# Altium schematic sheet WX0.007.101DL.SchDoc
size A3
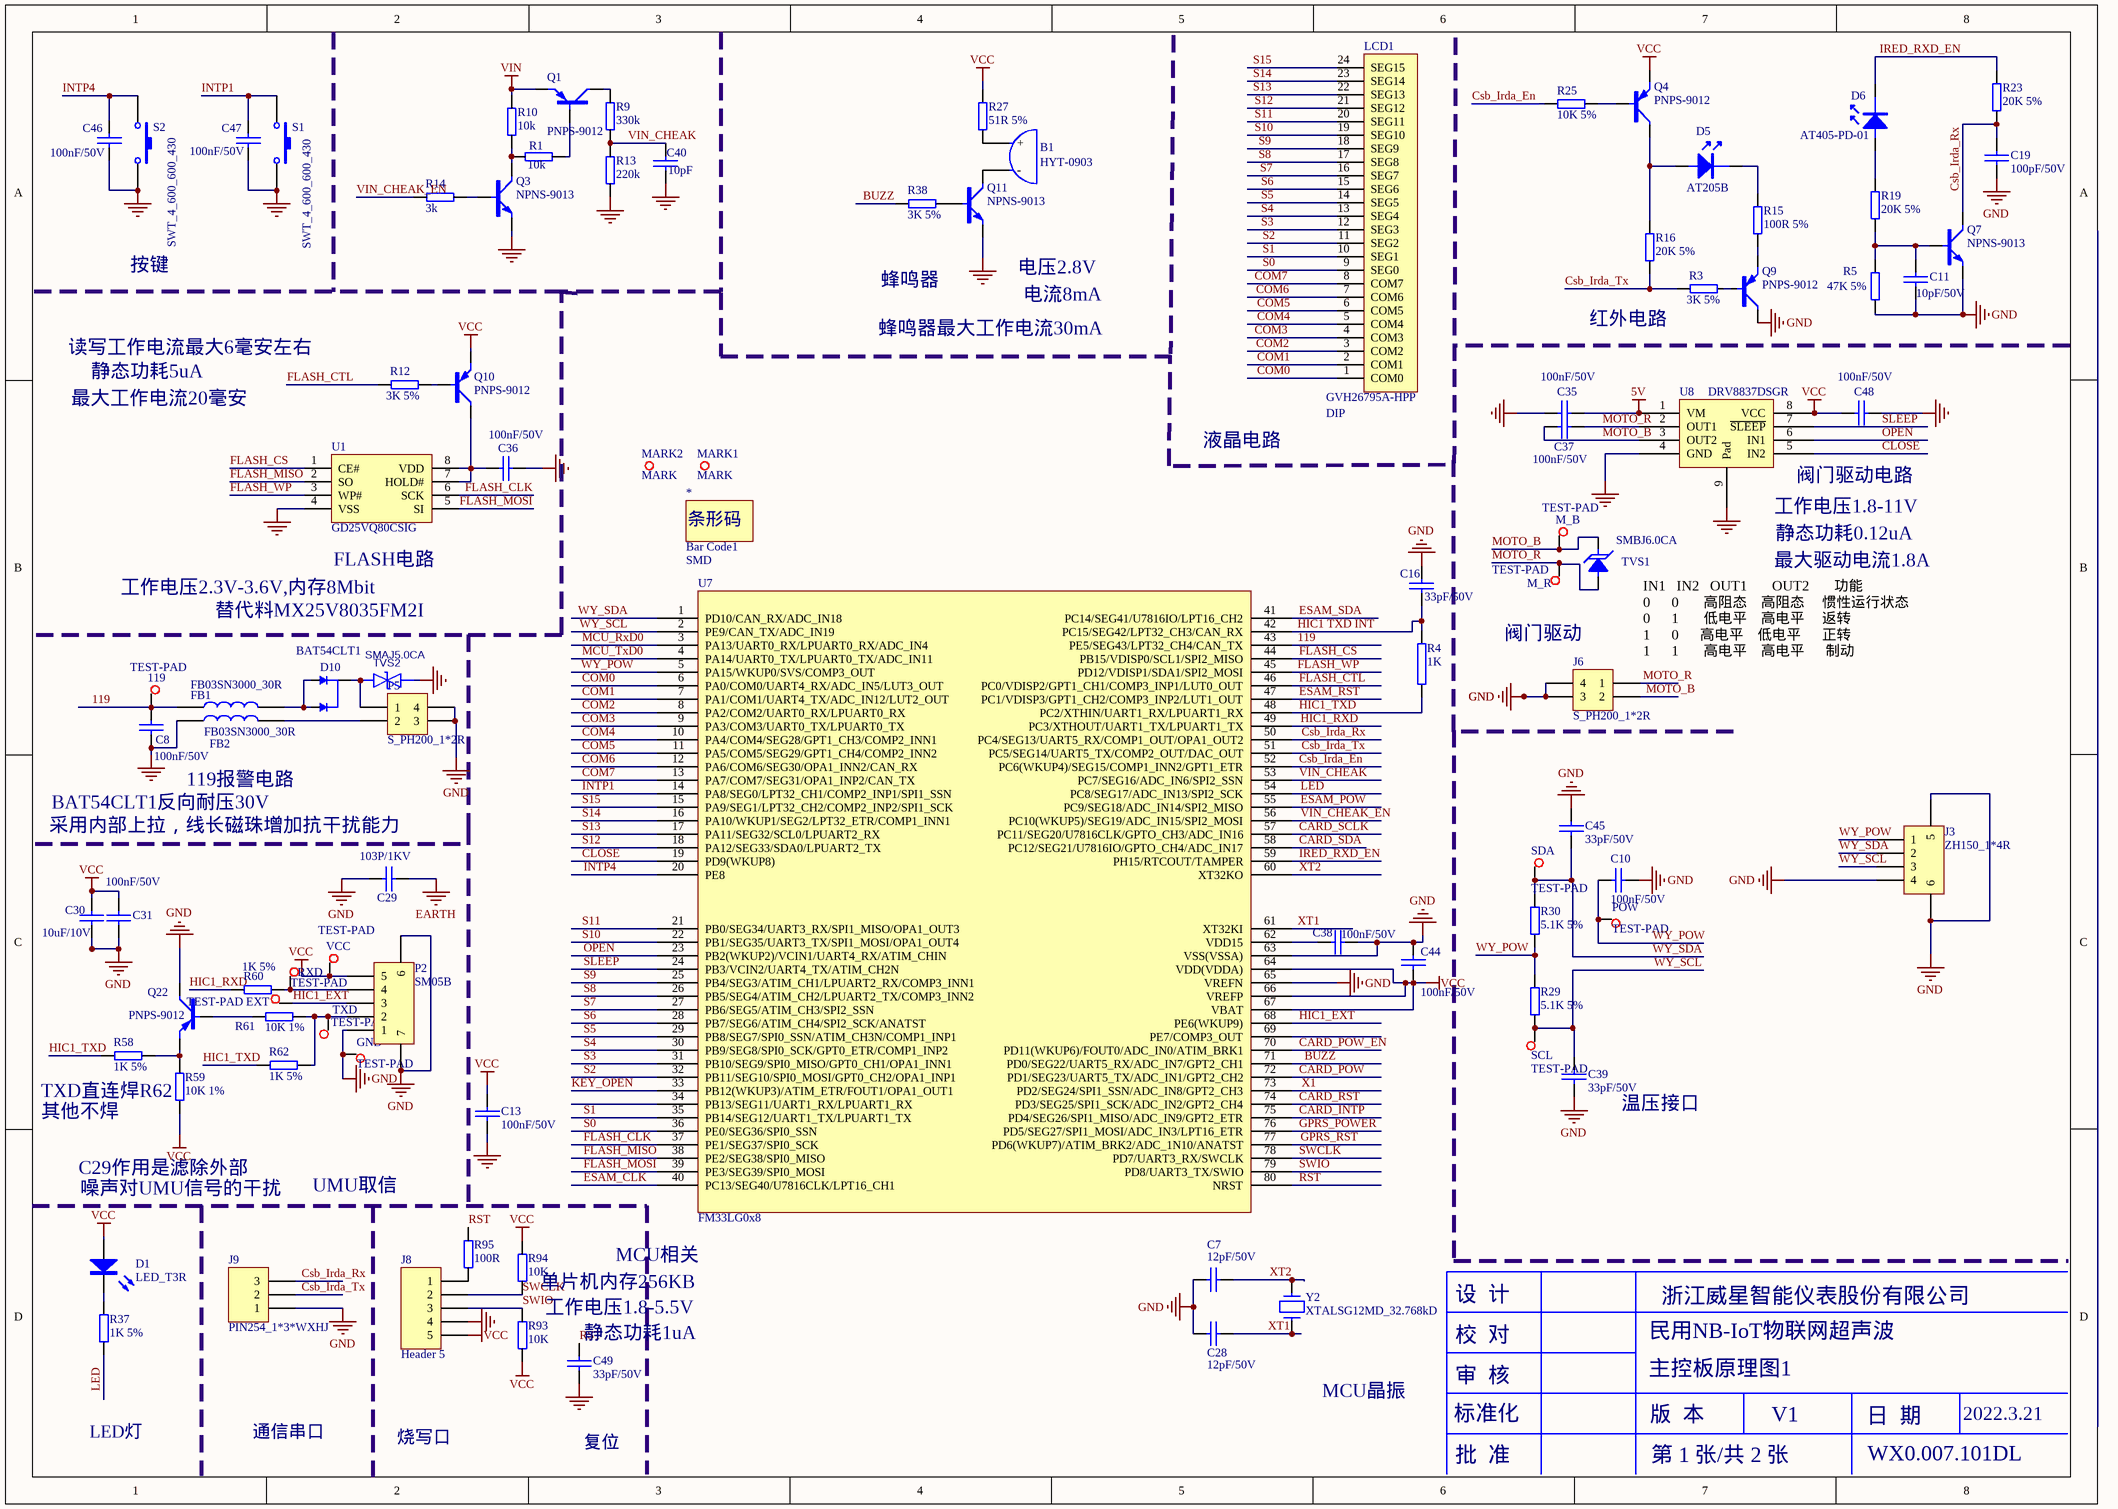
[diagram p0: WX0.007.101DL.SchDoc]

## Parts
119  TEST-PAD  [TEST-PAD]
*  Bar Code1  SMD/DIP: SMD  [Bar Code1]
B1  HYT-0903  [HYT-0903]
C7  12pF/50V  [CAP0603]
C8  100nF/50V  [CAP0603]
C10  100nF/50V  [CAP0603]
C11  10pF/50V  [CAP0603]
C13  100nF/50V  [CAP0603]
C16  33pF/50V  [CAP0603]
C19  100pF/50V  [CAP0603]
C28  12pF/50V  [CAP0603]
C29  103P/1KV  [CAP1206]
C30  10uF/10V  [CAP0603]
C31  100nF/50V  [CAP0603]
C35  100nF/50V  [CAP0603]
C36  100nF/50V  [CAP0603]
C37  100nF/50V  [CAP0603]
C38  100nF/50V  [CAP0603]
C39  33pF/50V  [CAP0603]
C40  10pF  [CAP0603]
C44  100nF/50V  [CAP0603]
C45  33pF/50V  [CAP0603]
C46  100nF/50V  [CAP0603]
C47  100nF/50V  [CAP0603]
C48  100nF/50V  [CAP0603]
C49  33pF/50V  [CAP0603]
D1  LED_T3R  [LED2_300]
D5  AT205B  [IR_254_1000_500]
D6  AT405-PD-01  [IR_254_1000_500]
D10  BAT54CLT1  [SOT-23]
EXT  TEST-PAD  [TEST-PAD]
FB1  FB03SN3000_30R  [IND0603]
FB2  FB03SN3000_30R  [IND0603]
GND  TEST-PAD  [TEST-PAD]
J3  ZH150_1*4R  [SMT-1.5-4]
J6  S_PH200_1*2R  [SMT2-2.0]
J8  Header 5  [PIN254_1*5SR]
J9  PIN254_1*3*WXHJ  [PIN254_1*3*WXHJ]
LCD1  GVH26795A-HPP  SMD/DIP: DIP  [JR-H25808ARP]
M_B  TEST-PAD  [TEST-PAD]
M_R  TEST-PAD  [TEST-PAD]
MARK1  MARK  [MARK]
MARK2  MARK  [MARK]
P2  SM05B  [SMT-1.25-5]
P5  S_PH200_1*2R  [SMT2-2.0]
POW  TEST-PAD  [TEST-PAD]
Q1  PNPS-9012  [SOT-23]
Q3  NPNS-9013  [SOT-23]
Q4  PNPS-9012  [SOT-23]
Q7  NPNS-9013  [SOT-23]
Q9  PNPS-9012  [SOT-23]
Q10  PNPS-9012  [SOT-23]
Q11  NPNS-9013  [SOT-23]
Q22  PNPS-9012  [SOT-23]
R1  10k  [RES0603]
R3  3K 5%  [RES0603]
R4  1K  [RES0603]
R5  47K 5%  [RES0603]
R9  330k  [RES0603]
R10  10k  [RES0603]
R12  3K 5%  [RES0603]
R13  220k  [RES0603]
R14  3k  [RES0603]
R15  100R 5%  [RES0603]
R16  20K 5%  [RES0603]
R19  20K 5%  [RES0603]
R23  20K 5%  [RES0603]
R25  10K 5%  [RES0603]
R27  51R 5%  [RES0603]
R29  5.1K 5%  [RES0603]
R30  5.1K 5%  [RES0603]
R37  1K 5%  [RES0603]
R38  3K 5%  [RES0603]
R58  1K 5%  [RES0603]
R59  10K 1%  [RES0603]
R60  1K 5%  [RES0603]
R61  10K 1%  [RES0603]
R62  1K 5%  [RES0603]
R93  10K  [RES0603]
R94  10K  [RES0603]
R95  100R  [RES0603]
RXD  TEST-PAD  [TEST-PAD]
S1  SWT_4_600_600_430  [SWT_4_600_600]
S2  SWT_4_600_600_430  [SWT_4_600_600]
SCL  TEST-PAD  [TEST-PAD]
SDA  TEST-PAD  [TEST-PAD]
TVS1  SMBJ6.0CA  [DO-214AA]
TVS2  SMAJ5.0CA  [SMAJ5.0CA]
TXD  TEST-PAD  [TEST-PAD]
U1  GD25VQ80CSIG  [SOP-8L-200MIL]
U7  FM33LG0x8  [LQFP80]
U8  DRV8837DSGR  [S-PWSON-N8]
VCC  TEST-PAD  [TEST-PAD]
Y2  XTALSG12MD_32.768kD  [SMD-3215_2P]

## Nets
5V: C35.1 U8.1(VM)
EARTH: C29.1
GND: C7.1 C8.2 C10.2 C11.2 C13.1 C16.2 C19.2 C28.1 C29.2 C30.2 C31.2 C35.2 C36.2 C38.2 C39.1 C40.1 C44.1 C45.2 C46.1 C47.1 C48.1 C49.1 FB2.1 GND.1 J3.4 J3.5 J3.6 J6.3 J6.4 J8.4 J9.1 P2.1 P2.6 P2.7 P5.3 P5.4 Q3.2(E) Q7.2(E) Q9.3(C) Q11.2(E) Q22.3(C) R5.1 R13.2 S1.2 S2.2 TVS2.2 U1.4(VSS) U7.63(VSS(VSSA)) U7.65(VREFN) U8.4(GND) U8.9(Pad)
VCC: C13.2 C30.1 C31.1 C44.2 C48.2 D1.1 J8.5 P2.5 Q4.2(E) Q10.2(E) R27.2 R59.2 R93.1 R94.2 U7.64(VDD(VDDA)) U7.66(VREFP) U7.67(VBAT) U8.8(VCC) VCC.1
VIN: Q1.2(E) R10.2
119: 119.1 C8.1 FB1.1 U7.43(PE5/SEG43/LPT32_CH4/CAN_TX)
BUZZ: R38.1 U7.71(PD0/SEG22/UART5_RX/ADC_IN7/GPT2_CH1)
CARD_INTP: U7.75(PD4/SEG26/SPI1_MISO/ADC_IN9/GPT2_ETR)
CARD_POW: U7.72(PD1/SEG23/UART5_TX/ADC_IN1/GPT2_CH2)
CARD_POW_EN: U7.70(PD11(WKUP6)/FOUT0/ADC_IN0/ATIM_BRK1)
CARD_RST: U7.74(PD3/SEG25/SPI1_SCK/ADC_IN2/GPT2_CH4)
CARD_SCLK: U7.57(PC11/SEG20/U7816CLK/GPTO_CH3/ADC_IN16)
CARD_SDA: U7.58(PC12/SEG21/U7816IO/GPTO_CH4/ADC_IN17)
CLOSE: U7.19(PD9(WKUP8)) U8.5(IN2)
COM0: LCD1.1(COM0) U7.6(PA0/COM0/UART4_RX/ADC_IN5/LUT3_OUT)
COM1: LCD1.2(COM1) U7.7(PA1/COM1/UART4_TX/ADC_IN12/LUT2_OUT)
COM2: LCD1.3(COM2) U7.8(PA2/COM2/UART0_RX/LPUART0_RX)
COM3: LCD1.4(COM3) U7.9(PA3/COM3/UART0_TX/LPUART0_TX)
COM4: LCD1.5(COM4) U7.10(PA4/COM4/SEG28/GPT1_CH3/COMP2_INN1)
COM5: LCD1.6(COM5) U7.11(PA5/COM5/SEG29/GPT1_CH4/COMP2_INN2)
COM6: LCD1.7(COM6) U7.12(PA6/COM6/SEG30/OPA1_INN2/CAN_RX)
COM7: LCD1.8(COM7) U7.13(PA7/COM7/SEG31/OPA1_INP2/CAN_TX)
Csb_Irda_En: R25.2 U7.52(PC6(WKUP4)/SEG15/COMP1_INN2/GPT1_ETR)
Csb_Irda_Rx: C19.1 J9.3 Q7.3(C) R23.1 U7.50(PC4/SEG13/UART5_RX/COMP1_OUT/OPA1_OUT2)
Csb_Irda_Tx: J9.2 R3.1 R16.1 U7.51(PC5/SEG14/UART5_TX/COMP2_OUT/DAC_OUT)
ESAM_CLK: U7.40(PC13/SEG40/U7816CLK/LPT16_CH1)
ESAM_POW: U7.55(PC9/SEG18/ADC_IN14/SPI2_MISO)
ESAM_RST: U7.47(PC1/VDISP3/GPT1_CH2/COMP3_INP2/LUT1_OUT)
ESAM_SDA: U7.41(PC14/SEG41/U7816IO/LPT16_CH2)
FLASH_CLK: U1.6(SCK) U7.37(PE1/SEG37/SPI0_SCK)
FLASH_CS: U1.1(CE#) U7.44(PB15/VDISP0/SCL1/SPI2_MISO)
FLASH_CTL: R12.1 U7.46(PC0/VDISP2/GPT1_CH1/COMP3_INP1/LUT0_OUT)
FLASH_MISO: U1.2(SO) U7.38(PE2/SEG38/SPI0_MISO)
FLASH_MOSI: U1.5(SI) U7.39(PE3/SEG39/SPI0_MOSI)
FLASH_WP: U1.3(WP#) U7.45(PD12/VDISP1/SDA1/SPI2_MOSI)
GPRS_POWER: U7.76(PD5/SEG27/SPI1_MOSI/ADC_IN3/LPT16_ETR)
GPRS_RST: U7.77(PD6(WKUP7)/ATIM_BRK2/ADC_1N10/ANATST)
HIC1 TXD INT: C16.1 R4.2 U7.42(PC15/SEG42/LPT32_CH3/CAN_RX)
HIC1_EXT: EXT.1 P2.3 U7.68(PE6(WKUP9))
HIC1_RXD: R60.1 U7.49(PC3/XTHOUT/UART1_TX/LPUART1_TX)
HIC1_TXD: R4.1 R58.1 R62.1 U7.48(PC2/XTHIN/UART1_RX/LPUART1_RX)
INTP1: C47.2 S1.1 U7.14(PA8/SEG0/LPT32_CH1/COMP2_INP1/SPI1_SSN)
INTP4: C46.2 S2.1 U7.20(PE8)
IRED_RXD_EN: D6.2 R23.2 U7.59(PH15/RTCOUT/TAMPER)
KEY_OPEN: U7.33(PB12(WKUP3)/ATIM_ETR/FOUT1/OPA1_OUT1)
LED: R37.1 U7.54(PC8/SEG17/ADC_IN13/SPI2_SCK)
MCU_RxD0: U7.3(PA13/UART0_RX/LPUART0_RX/ADC_IN4)
MCU_TxD0: U7.4(PA14/UART0_TX/LPUART0_TX/ADC_IN11)
MOTO_B: C37.2 J6.2 M_B.1 TVS1.2 U8.3(OUT2)
MOTO_R: C37.1 J6.1 M_R.1 TVS1.1 U8.2(OUT1)
OPEN: U7.23(PB2(WKUP2)/VCIN1/UART4_RX/ATIM_CHIN) U8.6(IN1)
RST: C49.2 R95.1 U7.80(NRST)
S0: LCD1.9(SEG0) U7.36(PE0/SEG36/SPI0_SSN)
S1: LCD1.10(SEG1) U7.35(PB14/SEG12/UART1_TX/LPUART1_TX)
S2: LCD1.11(SEG2) U7.32(PB11/SEG10/SPI0_MOSI/GPT0_CH2/OPA1_INP1)
S3: LCD1.12(SEG3) U7.31(PB10/SEG9/SPI0_MISO/GPT0_CH1/OPA1_INN1)
S4: LCD1.13(SEG4) U7.30(PB9/SEG8/SPI0_SCK/GPT0_ETR/COMP1_INP2)
S5: LCD1.14(SEG5) U7.29(PB8/SEG7/SPI0_SSN/ATIM_CH3N/COMP1_INP1)
S6: LCD1.15(SEG6) U7.28(PB7/SEG6/ATIM_CH4/SPI2_SCK/ANATST)
S7: LCD1.16(SEG7) U7.27(PB6/SEG5/ATIM_CH3/SPI2_SSN)
S8: LCD1.17(SEG8) U7.26(PB5/SEG4/ATIM_CH2/LPUART2_TX/COMP3_INN2)
S9: LCD1.18(SEG9) U7.25(PB4/SEG3/ATIM_CH1/LPUART2_RX/COMP3_INN1)
S10: LCD1.19(SEG10) U7.22(PB1/SEG35/UART3_TX/SPI1_MOSI/OPA1_OUT4)
S11: LCD1.20(SEG11) U7.21(PB0/SEG34/UART3_RX/SPI1_MISO/OPA1_OUT3)
S12: LCD1.21(SEG12) U7.18(PA12/SEG33/SDA0/LPUART2_TX)
S13: LCD1.22(SEG13) U7.17(PA11/SEG32/SCL0/LPUART2_RX)
S14: LCD1.23(SEG14) U7.16(PA10/WKUP1/SEG2/LPT32_ETR/COMP1_INN1)
S15: LCD1.24(SEG15) U7.15(PA9/SEG1/LPT32_CH2/COMP2_INP2/SPI1_SCK)
SLEEP: U7.24(PB3/VCIN2/UART4_TX/ATIM_CH2N) U8.7(~{SLEEP})
SWCLK: J8.2 R94.1 U7.78(PD7/UART3_RX/SWCLK)
SWIO: J8.3 R93.2 U7.79(PD8/UART3_TX/SWIO)
VIN_CHEAK: C40.2 R9.2 R13.1 U7.53(PC7/SEG16/ADC_IN6/SPI2_SSN)
VIN_CHEAK_EN: R14.1 U7.56(PC10(WKUP5)/SEG19/ADC_IN15/SPI2_MOSI)
WY_POW: C10.1 J3.1 POW.1 R29.1 R30.1 U7.5(PA15/WKUP0/SVS/COMP3_OUT)
WY_SCL: C39.2 J3.3 R29.2 SCL.1 U7.2(PE9/CAN_TX/ADC_IN19)
WY_SDA: C45.1 J3.2 R30.2 SDA.1 U7.1(PD10/CAN_RX/ADC_IN18)
X1: U7.73(PD2/SEG24/SPI1_SSN/ADC_IN8/GPT2_CH3)
XT1: C28.2 U7.61(XT32KI) Y2.1
XT2: C7.2 U7.60(XT32KO) Y2.2
NetB1_1: B1.1(+) R27.1
NetB1_2: B1.2(-) Q11.3(C)
NetC11_1: C11.1 Q7.1(B) R5.2 R19.1
NetC36_1: C36.1 Q10.3(C) U1.7(HOLD#) U1.8(VDD)
NetC38_1: C38.1 U7.62(VDD15)
NetD1_2: D1.2 R37.2
NetD5_1: D5.1 Q4.3(C) R16.2
NetD5_2: D5.2 R15.2
NetD6_1: D6.1 R19.2
NetD10_1: D10.1(A) D10.2(A) FB1.2
NetD10_3: D10.3(C) P5.1 TVS2.1
NetFB2_2: FB2.2 P5.2
NetJ8_1: J8.1 R95.2
NetP2_2: P2.2 R61.2 R62.2 TXD.1
NetP2_4: P2.4 R60.2 RXD.1
NetQ1_1: Q1.1(B) R1.2
NetQ1_3: Q1.3(C) R9.1
NetQ3_1: Q3.1(B) R14.2
NetQ3_3: Q3.3(C) R1.1 R10.1
NetQ4_1: Q4.1(B) R25.1
NetQ9_1: Q9.1(B) R3.2
NetQ9_2: Q9.2(E) R15.1
NetQ10_1: Q10.1(B) R12.2
NetQ11_1: Q11.1(B) R38.2
NetQ22_1: Q22.1(B) R61.1
NetQ22_2: Q22.2(E) R58.2 R59.1

Not connected (* = marked no-connect by the designer): U7 34(PB13/SEG11/UART1_RX/LPUART1_RX) 69(PE7/COMP3_OUT)

## Notes on the sheet
- 按键
- 蜂鸣器
- (near Q11) 电压2.8V
- 电流8mA
- 读写工作电流最大6毫安左右
- 静态功耗5uA
- 蜂鸣器最大工作电流30mA
- 红外电路
- 最大工作电流20毫安
- 液晶电路
- (near U8) 工作电压1.8-11V
- (near U8) 阀门驱动电路
- (near U1) FLASH电路
- 最大驱动电流1.8A
- 静态功耗0.12uA
- 工作电压2.3V-3.6V,内存8Mbit
- 替代料MX25V8035FM2I
- 阀门驱动
- IN1   IN2   OUT1       OUT2       功能
  0      0       高阻态    高阻态     惯性运行状态
  0      1       低电平    高电平     返转
  1      0      高电平    低电平      正转
  1      1       高电平    高电平      制动
- 119报警电路
- 采用内部上拉，线长磁珠增加抗干扰能力
- BAT54CLT1反向耐压30V
- (near R58) TXD直连焊R62
- 其他不焊
- (near C39) 温压接口
- C29作用是滤除外部
- UMU取信
- 噪声对UMU信号的干扰
- MCU相关
- 工作电压1.8-5.5V
- 单片机内存256KB
- 静态功耗1uA
- 设  计
- 浙江威星智能仪表股份有限公司
- MCU晶振
- 审  核
- 校  对
- 民用NB-IoT物联网超声波
- 主控板原理图1
- LED灯
- 通信串口
- 烧写口
- 复位
- 标准化
- 批  准
- 版  本
- 第 1 张/共 2 张
- V1
- 日  期
- WX0.007.101DL
- 2022.3.21

## Library data of the parts
119 EXT GND M_B M_R POW RXD SCL SDA TXD VCC = AD_WXHJ_TEST-PAD_01: 单面焊盘测试点; Part Name: 测试点; ID: 23; SMD/DIP: SMD; Part Number: AD_WXHJ_TEST-PAD_01
* = AD_WXHJ_Bar Code_02: 条形码 ,填充，无需焊接器件; ID: 17; Part Number: AD_WXHJ_Bar Code_02; Part Name: 条形码
B1 = 1010602-0007: 直插,直径9mm,高5.5mm,5 V,2 V,30 mA,兴化市华宇电子有限公司,HYT-0903; Part Name: 有源蜂鸣器; ID: 28; SMD/DIP: DIP; Part Number: 1010602-0007
C7 C28 = 101020103-0005: 12P,50 V,±5%,0603,国巨,CC0603JRNPO9BN12; Part Name: 0603贴片电容; ID: 11; SMD/DIP: SMD; Part Number: 101020103-0005
C8 C10 C13 C31 C35-C38 C44 C46-C48 = 101020103-0021: 104pF,50 V,±10%,0603,国巨,CC0603KRX7R9BB104; Part Name: 0603贴片电容; ID: 3; SMD/DIP: SMD; Part Number: 101020103-0021
C11 = 101020103-0014: 10pF,50 V,±5%,0603,X7R,国巨,CC0603JRNPO9BN100; Part Name: 0603贴片电容; ID: 7; SMD/DIP: SMD; Part Number: 101020103-0014
C16 = 101020103-0027: 33pF,50 V,±10%,0603,国巨,CC0603KRNPO9BN33; Part Name: 0603贴片电容; ID: 18; SMD/DIP: SMD; Part Number: 101020103-0027
C19 = 101020103-0010: 101pf,50 V,±5%,0603,国巨,CC0603JRNP09BN101; Part Name: 0603贴片电容; ID: 4; SMD/DIP: SMD; Part Number: 101020103-0010
C29 = 101020103-0021: 103P/1KV,±10％,1206; Part Number: 101020101-0003; Part Name: 1206贴片电容; ID: 3; SMD/DIP: SMD
C30 = 101020103-0026: 106pF,10 V,±10%,0603,村田,GRM188R61A106KE47D; Part Name: 0603贴片电容; ID: 8; SMD/DIP: SMD; Part Number: 101020103-0026
C39 C45 C49 = 101020103-0027: 33pF,50 V,±10%,0603,国巨,CC0603KRNPO9BN33; Part Name: 0603贴片电容; ID: 17; SMD/DIP: SMD; Part Number: 101020103-0027
C40 = CAP: 无极性电容
D1 = 101040102-0001: 圆形插件,3mm 圆形,插件,红光,湖北匡通电子有限公司,3BB4HC; Part Name: 发光二极管; ID: 6; SMD/DIP: DIP; Part Number: 101040102-0001
D5 = 101040101-0034: 直插,Φ5.8mm圆头透明色，,0.1 A,4 V,5 V,上海品观电子有限公司,AT205B; Part Name: 红外发射管; ID: 2; SMD/DIP: DIP; Part Number: 101040101-0034
D6 = 101040101-0035: Φ5.8mm圆头黑色，光电接收管,Φ5.8mm,0.01 A,1.2 V,60 V,上海品观电子,AT405-PD-01; Part Name: 光敏二极管; ID: 4; SMD/DIP: DIP; Part Number: 101040101-0035
D10 = 101040101-0038: BAT54CLT1，SOT23-3,SOT23-3,0.2 A,0.8 V,30 V,安森美,BAT54CLT1; Part Name: 贴片肖特基; ID: 31; SMD/DIP: SMD; Part Number: 101040101-0038
FB1 FB2 = 109010101-0003: chilisin(奇力新),0603,30Ω ±25% @100MHz,150 V,125 ℃,PBY160808T-300Y-N,-55 ℃,不含铅,,,圆盘,30Ω ±25% @100MHz; Part Name: 磁珠; ID: 25; SMD/DIP: SMD; Part Number: 109010101-0003
J3 = 1010902-0126: 4针1.5mm间距，贴片卧式,9.0mm*6.5mm,公头,单排,4针1.5mm间距，贴片卧式; Part Name: ZH座; ID: 28; SMD/DIP: SMD; Part Number: 1010902-0126
J6 P5 = 1010902-0125: PH2.0_2AWR 卧,贴片卧式,母头,单排,2针2.0mm; Part Name: PH座; ID: 24; SMD/DIP: SMD; Part Number: 1010902-0125
J8 = Header 5: Header, 5-Pin
J9 = AD_WXHJ_PinHeader_04: 1*3 ，Φ1.0 ，2.54mm，直脚,无需焊接器件; Part Name: 排针; ID: 17; SMD/DIP: DIP; Part Number: AD_WXHJ_PinHeader_04
LCD1 = 1010801-0050: 4.4V,61mm*23.5mm*26mm,针脚,段码,126,HTN,半透,60 ℃,-20 ℃,安徽金视界光电科技有限公司,GVH25995A-HPP; Part Name: LCD液晶屏; ID: 10; Part Number: 1010801-0050
MARK1 MARK2 = AD_WXHJ_MARK_01: MARK点; ID: 8; SMD/DIP: SMD; Part Number: AD_WXHJ_MARK_01; Part Name: MARK点
Q1 Q4 Q9 Q10 = 101040201-0001: 9012,PNP,SOT-23,JCET;长电,S9012; Part Name: 贴片三极管; ID: 16; SMD/DIP: SMD; Part Number: 101040201-0001
Q3 Q7 Q11 = 101040201-0002: 9013,NPN,SOT-23,长电,S9013; Part Name: 贴片三极管; ID: 14; SMD/DIP: SMD; Part Number: 101040201-0002
Q22 = 101040201-0001: 9012,PNP,SOT-23,JCET;长电,S9012; Part Name: 贴片三极管; ID: 17; SMD/DIP: SMD; Part Number: 101040201-0001
R1 R9 R10 R13 R14 R93-R95 = RES
R3 R12 R38 = 101010103-0006: 国巨,±5%,0603,,155 ℃,-55 ℃,RC0603JR-073KL,无铅,100 ppm/℃,1/10W,,3K; Part Name: 0603贴片电阻; ID: 22; SMD/DIP: SMD; Part Number: 101010103-0006
R4 = RES2
R5 = 101010103-0012: 47K,±5%,1/10W,0603,国巨,RC0603JR-0747KL; Part Name: 0603贴片电阻; ID: 25; SMD/DIP: SMD; Part Number: 101010103-0012
R15 = 101010103-0022: 100R,±5%,1/10W,0603,国巨,RC0603JR-07100RL; Part Name: 0603贴片电阻; ID: 5; SMD/DIP: SMD; Part Number: 101010103-0022
R16 R19 R23 = 101010103-0004: 国巨,±5%,0603,,155 ℃,-55 ℃,RC0603JR-0720KL,无铅,200 ppm/℃,1/10W,,20K; Part Name: 0603贴片电阻; ID: 15; SMD/DIP: SMD; Part Number: 101010103-0004
R25 = 101010103-0003: 国巨,±5%,0603,,155 ℃,-55 ℃,RC0603JR-0710KL,无铅,200 ppm/℃,1/10W,,10K; Part Name: 0603贴片电阻; ID: 7; SMD/DIP: SMD; Part Number: 101010103-0003
R27 = 101010103-0037: 国巨,±5%,0603,,155 ℃,-55 ℃,RC0603JR-0751RL,无铅,100 ppm/℃,1/10W,,51欧; Part Name: 0603贴片电阻; ID: 28; SMD/DIP: SMD; Part Number: 101010103-0037
R29 R30 = 101010103-0015: 国巨,±5%,0603,,155 ℃,55 ℃,RC0603JR-075.1KL,无铅,200 ppm/℃,1/10W,,5.1k; Part Name: 0603贴片电阻; ID: 26; SMD/DIP: SMD; Part Number: 101010103-0015
R37 = 101010103-0008: 1K,±5%,1/10W,0603,国巨,RC0603JR-071KL; Part Name: 0603贴片电阻; ID: 9; SMD/DIP: SMD; Part Number: 101010103-0008
R58 R60 R62 = 101010103-0008: 1K,±5%,1/10W,0603,国巨,RC0603JR-071KL; Part Name: 0603贴片电阻; ID: 10; SMD/DIP: SMD; Part Number: 101010103-0008
R59 R61 = 101010103-0052: 10K±1%,1/10W,0603; Part Name: 0603贴片电阻; ID: 6; SMD/DIP: SMD; Part Number: 101010103-0052
S1 S2 = 1011001-0027: TS-1102,机械轻触,6*6*4.3直插,6*6*4.3直插,乐清市羽欧电子; Part Name: 按键; ID: 30; SMD/DIP: DIP; Part Number: 1011001-0027
TVS1 = 101040101-0024: SMBJ6.0CA,DO-214AA,10.3 V,6.0 V,600 W,58.3 A,800 uA,上海君耀电子有限公司,SMBJ6.0CA; Part Name: TVS管; ID: 23; SMD/DIP: SMD; Part Number: 101040101-0024
TVS2 = SMAJ5.0CA_C693487: BOM_Manufacturer: FTR; Contributor: LCSC; BOM_Supplier: LCSC; BOM_Supplier Part: C693487; BOM_Manufacturer Part: SMAJ5.0CA; BOM_JLCPCB Part Class: Extended Part; spicePre: D; spiceSymbolName: SMAJ5.0CA_C693487
U1 = 101050101-0165: GD25VQ80CSIG,SOP8 208mil,北京兆易创新科技股份有限公司,GD25VQ80CSIG; Part Name: 贴片存储芯片FLASH; ID: 14; SMD/DIP: SMD; Part Number: 101050101-0165
U8 = 101050101-0060: DRV8837DSGR,S-PWSON-N8,TI,DRV8837DSGR; Part Name: 驱动芯片; ID: 23; SMD/DIP: SMD; Part Number: 101050101-0060
Y2 = 1010601-0009: SCX3215(SCX3213089);32.768kHz;精度20%;负载电容12.5pF,3215,32.768kHz,0.03 ppm/℃,无源,Q-SC32S03220C5AAAF,SCX3215; Part Name: 贴片晶振; ID: 20; SMD/DIP: SMD; Part Number: 1010601-0009